# Altium schematic sheet CPU.SchDoc: param:Title
size A4; Author: param.Autor; Version: param:Version
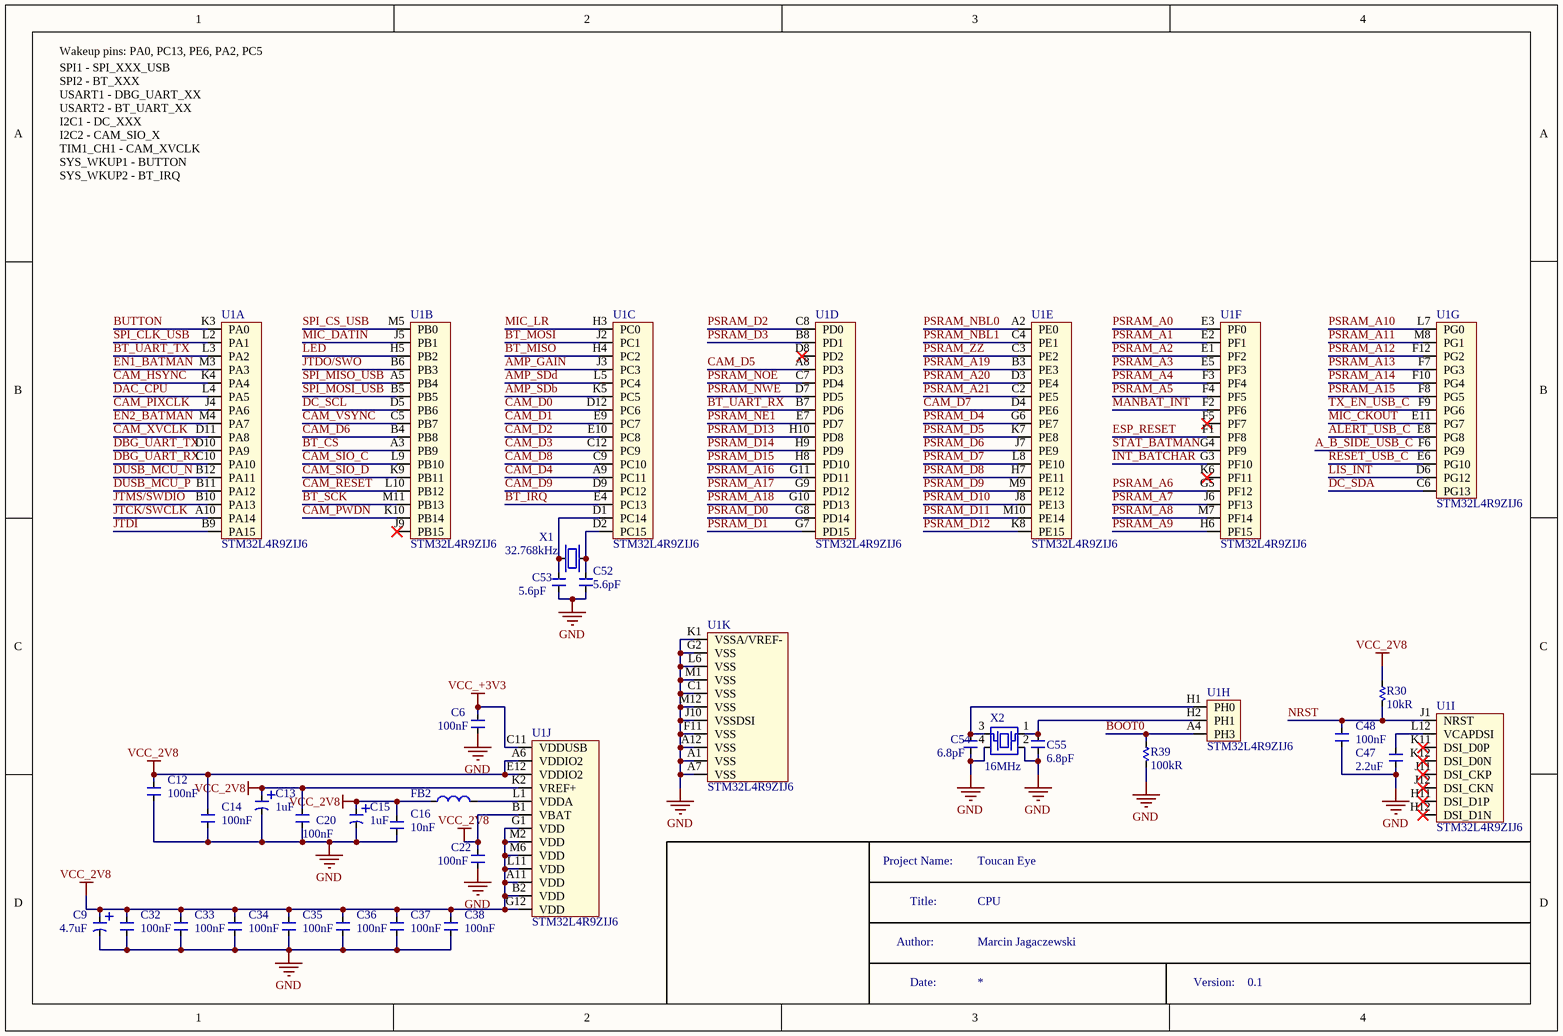
[diagram p0: CPU.SchDoc]

## Parts
C6  Capacitance: 100nF  [C_0201]  (hidden comment: C0201_100n_GRM033R6YA104KE14D)
C9  Capacitance: 4.7uF  [C_3216]  (hidden comment: C_4.7u_TANTAL_A_TAJA475K016UNJ)
C12  Capacitance: 100nF  [C_0201]  (hidden comment: C0201_100n_GRM033R6YA104KE14D)
C13  Capacitance: 1uF  [C_3216]  (hidden comment: C_1u_TANTAL_A_293D105X0025A2TE3)
C14  Capacitance: 100nF  [C_0201]  (hidden comment: C0201_100n_GRM033R6YA104KE14D)
C15  Capacitance: 1uF  [C_3216]  (hidden comment: C_1u_TANTAL_A_293D105X0025A2TE3)
C16  Capacitance: 10nF  [C_0201]  (hidden comment: C0201_10n_CGA1A2X7R1A103K030BA)
C20  Capacitance: 100nF  [C_0201]  (hidden comment: C0201_100n_GRM033R6YA104KE14D)
C22  Capacitance: 100nF  [C_0201]  (hidden comment: C0201_100n_GRM033R6YA104KE14D)
C32  Capacitance: 100nF  [C_0201]  (hidden comment: C0201_100n_GRM033R6YA104KE14D)
C33  Capacitance: 100nF  [C_0201]  (hidden comment: C0201_100n_GRM033R6YA104KE14D)
C34  Capacitance: 100nF  [C_0201]  (hidden comment: C0201_100n_GRM033R6YA104KE14D)
C35  Capacitance: 100nF  [C_0201]  (hidden comment: C0201_100n_GRM033R6YA104KE14D)
C36  Capacitance: 100nF  [C_0201]  (hidden comment: C0201_100n_GRM033R6YA104KE14D)
C37  Capacitance: 100nF  [C_0201]  (hidden comment: C0201_100n_GRM033R6YA104KE14D)
C38  Capacitance: 100nF  [C_0201]  (hidden comment: C0201_100n_GRM033R6YA104KE14D)
C47  Capacitance: 2.2uF  [C_0402]  (hidden comment: C0402_2.2u_GRT155R61E225KE13D)
C48  Capacitance: 100nF  [C_0201]  (hidden comment: C0201_100n_GRM033R6YA104KE14D)
C52  Capacitance: 5.6pF  [C_0201]  (hidden comment: C0201_5.6pF_GRM0335C1H5R6BA01D)
C53  Capacitance: 5.6pF  [C_0201]  (hidden comment: C0201_5.6pF_GRM0335C1H5R6BA01D)
C54  Capacitance: 6.8pF  [C_0201]  (hidden comment: C0201_6.8pF_GJM0335C1E6R8CB01D)
C55  Capacitance: 6.8pF  [C_0201]  (hidden comment: C0201_6.8pF_GJM0335C1E6R8CB01D)
FB2  BLM15AG121SN1D  [L_0402]  (value not drawn)
R30  Resistance: 10kR  [R_0201]  (hidden comment: R0201_10k_ERJ-1GNF1002C)
R39  Resistance: 100kR  [R_0201]  (hidden comment: R0201_100k_CRCW0201100KJN-ED)
U1  STM32L4R9ZIJ6  [BGA144C80P12X12_1000X1000X60]  (parts A,B,C,D,E,F,G,H,I,J,K of 11)
X1  Frequency: 32.768kHz  [CRYSTAL_1.6X1]  (hidden comment: ABS05-32.768KHZ-9-T)
X2  Freq: 16MHz  [CRYSTAL_2.5x2]  (hidden comment: CX2520DB16000F0FDFC1)

## Nets
GND: C6.2 C9.2 C12.2 C13.2 C14.2 C15.2 C16.2 C20.2 C22.1 C32.1 C33.1 C34.1 C35.1 C36.1 C37.1 C38.1 C47.1 C48.1 C52.1 C53.2 C54.2 C55.1 R39.1 U1.A1(VSS) U1.A7(VSS) U1.A12(VSS) U1.C1(VSS) U1.F11(VSS) U1.G2(VSS) U1.J10(VSSDSI) U1.K1(VSSA/VREF-) U1.L6(VSS) U1.M1(VSS) U1.M12(VSS) X2.2 X2.4
VCC_2V8: C9.1 C12.1 C13.1 C14.1 C15.1 C16.1 C20.1 C22.2 C32.2 C33.2 C34.2 C35.2 C36.2 C37.2 C38.2 FB2.1(Vcc) R30.2 U1.A6(VDDIO2) U1.A11(VDD) U1.B1(VBAT) U1.B2(VDD) U1.E12(VDDIO2) U1.G1(VDD) U1.G12(VDD) U1.K2(VREF+) U1.L11(VDD) U1.M2(VDD) U1.M6(VDD)
VCC_+3V3: C6.1 U1.C11(VDDUSB)
A_B_SIDE_USB_C: U1.F6(PG9)
ALERT_USB_C: U1.E8(PG8)
AMP_GAIN: U1.J3(PC3)
AMP_~{SDb}: U1.K5(PC5)
AMP_~{SDd}: U1.L5(PC4)
BOOT0: R39.2 U1.A4(PH3)
BT_CS: U1.A3(PB9)
BT_IRQ: U1.E4(PC13)
BT_MISO: U1.H4(PC2)
BT_MOSI: U1.J2(PC1)
BT_SCK: U1.M11(PB13)
BT_UART_RX: U1.B7(PD6)
BT_UART_TX: U1.L3(PA2)
BUTTON: U1.K3(PA0)
CAM_D0: U1.D12(PC6)
CAM_D1: U1.E9(PC7)
CAM_D2: U1.E10(PC8)
CAM_D3: U1.C12(PC9)
CAM_D4: U1.A9(PC11)
CAM_D5: U1.A8(PD3)
CAM_D6: U1.B4(PB8)
CAM_D7: U1.D4(PE6)
CAM_D8: U1.C9(PC10)
CAM_D9: U1.D9(PC12)
CAM_HSYNC: U1.K4(PA4)
CAM_PIXCLK: U1.J4(PA6)
CAM_PWDN: U1.K10(PB14)
CAM_RESET: U1.L10(PB12)
CAM_SIO_C: U1.L9(PB10)
CAM_SIO_D: U1.K9(PB11)
CAM_VSYNC: U1.C5(PB7)
CAM_XVCLK: U1.D11(PA8)
DAC_CPU: U1.L4(PA5)
DBG_UART_RX: U1.C10(PA10)
DBG_UART_TX: U1.D10(PA9)
DC_SCL: U1.D5(PB6)
DC_SDA: U1.C6(PG13)
DUSB_MCU_N: U1.B12(PA11)
DUSB_MCU_P: U1.B11(PA12)
EN1_BATMAN: U1.M3(PA3)
EN2_BATMAN: U1.M4(PA7)
ESP_RESET: U1.F1(PF8)
INT_BATCHAR: U1.G3(PF10)
JTCK/SWCLK: U1.A10(PA14)
JTDI: U1.B9(PA15)
JTDO/SWO: U1.B6(PB3)
JTMS/SWDIO: U1.B10(PA13)
LED: U1.H5(PB2)
LIS_INT: U1.D6(PG12)
MANBAT_INT: U1.F2(PF6)
MIC_CKOUT: U1.E11(PG7)
MIC_DATIN: U1.J5(PB1)
MIC_LR: U1.H3(PC0)
NRST: C48.2 R30.1 U1.J1(NRST)
PSRAM_A0: U1.E3(PF0)
PSRAM_A1: U1.E2(PF1)
PSRAM_A2: U1.E1(PF2)
PSRAM_A3: U1.E5(PF3)
PSRAM_A4: U1.F3(PF4)
PSRAM_A5: U1.F4(PF5)
PSRAM_A6: U1.G5(PF12)
PSRAM_A7: U1.J6(PF13)
PSRAM_A8: U1.M7(PF14)
PSRAM_A9: U1.H6(PF15)
PSRAM_A10: U1.L7(PG0)
PSRAM_A11: U1.M8(PG1)
PSRAM_A12: U1.F12(PG2)
PSRAM_A13: U1.F7(PG3)
PSRAM_A14: U1.F10(PG4)
PSRAM_A15: U1.F8(PG5)
PSRAM_A16: U1.G11(PD11)
PSRAM_A17: U1.G9(PD12)
PSRAM_A18: U1.G10(PD13)
PSRAM_A19: U1.B3(PE3)
PSRAM_A20: U1.D3(PE4)
PSRAM_A21: U1.C2(PE5)
PSRAM_D0: U1.G8(PD14)
PSRAM_D1: U1.G7(PD15)
PSRAM_D2: U1.C8(PD0)
PSRAM_D3: U1.B8(PD1)
PSRAM_D4: U1.G6(PE7)
PSRAM_D5: U1.K7(PE8)
PSRAM_D6: U1.J7(PE9)
PSRAM_D7: U1.L8(PE10)
PSRAM_D8: U1.H7(PE11)
PSRAM_D9: U1.M9(PE12)
PSRAM_D10: U1.J8(PE13)
PSRAM_D11: U1.M10(PE14)
PSRAM_D12: U1.K8(PE15)
PSRAM_D13: U1.H10(PD8)
PSRAM_D14: U1.H9(PD9)
PSRAM_D15: U1.H8(PD10)
PSRAM_NBL0: U1.A2(PE0)
PSRAM_NBL1: U1.C4(PE1)
PSRAM_NE1: U1.E7(PD7)
PSRAM_NOE: U1.C7(PD4)
PSRAM_NWE: U1.D7(PD5)
PSRAM_ZZ: U1.C3(PE2)
RESET_USB_C: U1.E6(PG10)
SPI_CLK_USB: U1.L2(PA1)
SPI_CS_USB: U1.M5(PB0)
SPI_MISO_USB: U1.A5(PB4)
SPI_MOSI_USB: U1.B5(PB5)
STAT_BATMAN: U1.G4(PF9)
TX_EN_USB_C: U1.F9(PG6)
NetC47_2: C47.2 U1.L12(VCAPDSI)
NetC52_2: C52.2 U1.D2(PC15) X1.2
NetC53_1: C53.1 U1.D1(PC14) X1.1
NetC54_1: C54.1 U1.H1(PH0) X2.3
NetC55_2: C55.2 U1.H2(PH1) X2.1
NetFB2_2: FB2.2(Vcc) U1.L1(VDDA)

Not connected (* = marked no-connect by the designer): U1 D8(PD2)* F5(PF7)* H11(DSI_D1P)* H12(DSI_D1N)* J9(PB15)* J11(DSI_CKP)* J12(DSI_CKN)* K6(PF11)* K11(DSI_D0P)* K12(DSI_D0N)*

## Notes on the sheet
- Wakeup pins: PA0, PC13, PE6, PA2, PC5
- SPI1 - SPI_XXX_USB
  SPI2 - BT_XXX
  USART1 - DBG_UART_XX
  USART2 - BT_UART_XX
  I2C1 - DC_XXX
  I2C2 - CAM_SIO_X
  TIM1_CH1 - CAM_XVCLK
  SYS_WKUP1 - BUTTON
  SYS_WKUP2 - BT_IRQ
- Project Name:
- Title:
- CPU
- Toucan Eye
- Author:
- Date:
- Marcin Jagaczewski
- Version:
- 0.1

## Library data of the parts
C6 C12 C14 C20 C22 C32-C38 C48 = C0201_100n_GRM033R6YA104KE14D: Multilayer Ceramic Capacitors MLCC - SMD/SMT 0201 0.10uF 35volts *Derate Voltage/Temp; Manufacturer: Murata; Tolerance: 10%; Dielectric: X5R; Voltage Rating (DC): 35V; Supplier 1: Mouser; Manufacturer Part Number: GRM033R6YA104KE14D; Stock 1: 295799; Pricing 1: 1=0.1, 10=0.061, 50=0.061, 100=0.027, 1000=0.015, 10000=0.01 (USD); Mount: Surface Mount; Case/Package: 0201; Weight: 1.2E-05oz; Case Code (Metric): 0603; Case Code (Imperial): 0201; Min Operating Temperature: -55°C; Max Operating Temperature: 85°C; Packaging: Tape and Reel; Voltage Rating: 35V; Termination: SMD/SMT; Package Quantity: 15000; Length: 0.024inch; Height: 0.3mm; Width: 0.3mm; Thickness: 0.013inch; ComponentLink1URL: http://www.mouser.com/ds/2/281/c02e-2905.pdf; ComponentLink1Description: http://www.mouser.com/ds/2/281/c02e-2905.pdf; ComponentLink2URL: http://search.murata.co.jp/Ceramy/image/img/A01X/partnumbering_e_01.pdf; ComponentLink2Description: http://search.murata.co.jp/Ceramy/image/img/A01X/partnumbering_e_01.pdf; *SCHChecked: *; *PCBChecked: *; Supplier Part Number 1: 81-GRM33R6YA104KE14D
C9 = C_4.7u_TANTAL_A_TAJA475K016UNJ: TANTALUM CHIPS, TAN; Manufacturer: Kyocera AVX; *SCHChecked: 1; Supplier 1: Mouser; Manufacturer Part Number: TAJA475K016UNJ; Stock 1: 7169; Pricing 1: 1=0.11, 10=0.11, 50=0.098, 100=0.088, 1000=0.064, 10000=0.056 (USD); Supplier Part Number 1: 581-TAJA475K016UNJ; *PCBChecked: 1
C13 C15 = C_1u_TANTAL_A_293D105X0025A2TE3: CAP TANT 1UF 25V 20% 1206; Manufacturer: Vishay Sprague; Dielectric Material: Tantalum; ESR (Equivalent Series Resistance): 7.6R; Ripple Current: 100mA; Leakage Current: 500nA; Polarity: Polar; Dissipation Factor: 4%; Voltage Rating (DC): 200kV; *SCHChecked: 1; Supplier 1: Mouser; Manufacturer Part Number: 293D105X0025A2TE3; Stock 1: 4878; Pricing 1: 1=0.17, 10=0.139, 50=0.135, 100=0.131, 1000=0.126, 10000=0.075 (USD); Mount: Surface Mount; Case/Package: 1206; Number of Pins: 2; Case Code (Imperial): 1206; Case Code (Metric): 3216; Min Operating Temperature: -55°C; Max Operating Temperature: 125°C; Tolerance: 20%; Packaging: Tape and Reel; Voltage Rating: 25V; Package Quantity: 2000; Termination: SMD/SMT; Length: 3.2mm; Height: 1.6mm; Width: 1.6mm; Height - Seated (Max): 0.071inch; Depth: 1.6mm; Radiation Hardening: No; REACH SVHC: Unknown; Lead Free: Lead Free; ComponentLink1URL: https://datasheet.ciiva.com/16631/293d-16631739.pdf; ComponentLink1Description: https://datasheet.ciiva.com/16631/293d-16631739.pdf; ComponentLink2URL: https://datasheet.ciiva.com/11245/293d-11245007.pdf; ComponentLink2Description: https://datasheet.ciiva.com/11245/293d-11245007.pdf; ComponentLink3URL: https://datasheet.ciiva.com/22644/1910915-22644415.pdf; ComponentLink3Description: https://datasheet.ciiva.com/22644/1910915-22644415.pdf; ComponentLink4URL: https://datasheet.ciiva.com/16293/293d-16293686.pdf; ComponentLink4Description: https://datasheet.ciiva.com/16293/293d-16293686.pdf; ComponentLink5URL: https://datasheet.ciiva.com/12884/293d-239871-12884008.pdf; ComponentLink5Description: https://datasheet.ciiva.com/12884/293d-239871-12884008.pdf; ComponentLink6URL: https://datasheet.ciiva.com/268/293d-268331.pdf; ComponentLink6Description: https://datasheet.ciiva.com/268/293d-268331.pdf; Supplier Part Number 1: 74-293D105X0025A2TE3; *PCBChecked: 1
C16 = C0201_10n_CGA1A2X7R1A103K030BA: 10000pF ±10% 10V X7R Ceramic Capacitor -55°C ~ 125°C Surface Mount, MLCC 0201 (0603 Metric) 0.024" L x 0.012" W (0.60mm x 0.30mm); Manufacturer: TDK; *SCHChecked: 1; Supplier 1: Mouser; Manufacturer Part Number: CGA1A2X7R1A103K030BA; Stock 1: 84981; Pricing 1: 1=0.11, 10=0.075, 50=0.075, 100=0.03, 1000=0.02, 10000=0.015 (USD); Mount: Surface Mount; Case/Package: 0201; Weight: 6E-06oz; Case Code (Metric): 0603; Case Code (Imperial): 0201; Min Operating Temperature: -55°C; Max Operating Temperature: 125°C; Package Quantity: 15000; Packaging: Tape and Reel; Tolerance: 10%; Voltage Rating: 10V; Dielectric: X7R; Termination: SMD/SMT; Voltage Rating (DC): 10V; Length: 0.024inch; Height: 0.3mm; Width: 0.012inch; Thickness: 0.012inch; ComponentLink1URL: http://www.mouser.com/ds/2/400/lcc_automotive_general_en-843974.pdf; ComponentLink1Description: http://www.mouser.com/ds/2/400/lcc_automotive_general_en-843974.pdf; ComponentLink2URL: http://product.tdk.com/capacitor/mlcc/en/documents/mlcc_automotive_general_en.pdf; ComponentLink2Description: http://product.tdk.com/capacitor/mlcc/en/documents/mlcc_automotive_general_en.pdf; ComponentLink3URL: https://product.tdk.com/info/en/catalog/datasheets/mlcc_automotive_general_en.pdf; ComponentLink3Description: https://product.tdk.com/info/en/catalog/datasheets/mlcc_automotive_general_en.pdf; Supplier Part Number 1: 810-CGA1A2X7R1A103KA; *PCBChecked: 1
C47 = C0402_2.2u_GRT155R61E225KE13D: 2.2µF 25V Ceramic Capacitor X5R 0402 (1005 Metric) 0.039" L x 0.020" W (1.00mm x 0.50mm); Manufacturer: Murata; Tolerance: 10%; *SCHChecked: 1; Supplier 1: Mouser; Manufacturer Part Number: GRT155R61E225KE13D; Stock 1: 15349; Mount: Surface Mount; Case/Package: 0402; Case Code (Metric): 1005; Case Code (Imperial): 0402; Min Operating Temperature: -55°C; Max Operating Temperature: 85°C; Packaging: Cut Tape; Voltage Rating: 25V; Dielectric: X5R; Voltage Rating (DC): 25V; Length: 0.039inch; Width: 0.02inch; Thickness: 0.022inch; ComponentLink1URL: http://search.murata.co.jp/Ceramy/image/img/A01X/G101/ENG/GRT155R61E225KE13-01.pdf; ComponentLink1Description: http://search.murata.co.jp/Ceramy/image/img/A01X/G101/ENG/GRT155R61E225KE13-01.pdf; Supplier Part Number 1: 81-GRT155R61E225KE3D; *PCBChecked: 1
C52 C53 = C0201_5.6pF_GRM0335C1H5R6BA01D: Multilayer Ceramic Capacitors MLCC - SMD/SMT 0201 5.6pF 50volts C0G +/-0.1pF; Manufacturer: Murata; Voltage Rating: 50V; *SCHChecked: 1; Supplier 1: Mouser; Manufacturer Part Number: GRM0335C1H5R6BA01D; Stock 1: 70824; Pricing 1: 1=0.1, 10=0.018, 50=0.018, 100=0.008, 1000=0.005, 10000=0.003 (USD); Mount: Surface Mount; Case/Package: 0201; Case Code (Metric): 0603; Case Code (Imperial): 0201; Min Operating Temperature: -55°C; Max Operating Temperature: 125°C; Package Quantity: 15000; Packaging: Tape and Reel; Voltage Rating (DC): 50V; Dielectric: C0G; Termination: SMD/SMT; Length: 0.6mm; Height: 0.3mm; Width: 0.012inch; Thickness: 0.013inch; Depth: 0.3mm; ComponentLink1URL: https://datasheet.ciiva.com/29538/partnumbering-e-01-29538488.pdf; ComponentLink1Description: https://datasheet.ciiva.com/29538/partnumbering-e-01-29538488.pdf; Supplier Part Number 1: 81-GRM0335C1H5R6BA1D; *PCBChecked: 1
C54 C55 = C0201_6.8pF_GJM0335C1E6R8CB01D: CAP CER 6.8PF 25V NP0 0201; Manufacturer: Murata; Dielectric: C0G; *SCHChecked: 1; Supplier 1: Mouser; Manufacturer Part Number: GJM0335C1E6R8CB01D; Stock 1: 86677; Pricing 1: 1=0.1, 10=0.045, 50=0.045, 100=0.02, 1000=0.011, 10000=0.008 (USD); Mount: Surface Mount; Case/Package: 0201; Case Code (Imperial): 0201; Case Code (Metric): 0603; Min Operating Temperature: -55°C; Max Operating Temperature: 125°C; Package Quantity: 1; Voltage Rating: 25V; Voltage Rating (DC): 25V; Packaging: Tape and Reel; Termination: SMD/SMT; Length: 0.6mm; Height: 0.3mm; Width: 0.3mm; Thickness: 0.013inch; Depth: 0.3mm; Radiation Hardening: No; Lead Free: Lead Free; ComponentLink1URL: https://datasheet.ciiva.com/11611/product-11611316.pdf; ComponentLink1Description: https://datasheet.ciiva.com/11611/product-11611316.pdf; ComponentLink2URL: https://datasheet.ciiva.com/133/partnumbering-e-01-133418.pdf; ComponentLink2Description: https://datasheet.ciiva.com/133/partnumbering-e-01-133418.pdf; ComponentLink3URL: https://datasheet.ciiva.com/133/partnumbering-e-01-133419.pdf; ComponentLink3Description: https://datasheet.ciiva.com/133/partnumbering-e-01-133419.pdf; ComponentLink4URL: https://datasheet.ciiva.com/11611/product-11611254.pdf; ComponentLink4Description: https://datasheet.ciiva.com/11611/product-11611254.pdf; ComponentLink5URL: https://datasheet.ciiva.com/133/partnumbering-e-01-133417.pdf; ComponentLink5Description: https://datasheet.ciiva.com/133/partnumbering-e-01-133417.pdf; Supplier Part Number 1: 81-GJM0335C1E6R8CB01; *PCBChecked: 1
FB2 = BLM15AG121SN1D: MURATA         BLM15AG121SN1D             FERRITE BEAD, 0.25OHM, 500MA, 0402; Material: Steel,Ferrite; Impedance: 120R; Tolerance: 25%; DC Resistance (DCR): 190mR; Current Rating: 550mA; Test Frequency: 100MHz; Number of Lines: 1; Shielding: Unshielded; Supplier 1: Mouser; Manufacturer: Murata; Manufacturer Part Number: BLM15AG121SN1D; Stock 1: 102744; Pricing 1: 1=0.1, 10=0.06, 50=0.06, 100=0.035, 1000=0.025, 10000=0.02 (USD); Case/Package: 0402; Number of Pins: 2; Core Material: Ferrite; Case Code (Metric): 1005; Case Code (Imperial): 0402; Min Operating Temperature: -55°C; Max Operating Temperature: 125°C; Max DC Current: 500mA; Package Quantity: 1; Packaging: Tape and Reel; Max Current Rating: 550mA; Termination: SMD/SMT; DC Current: 500mA; Military Standard: Not; Frequency: 100MHz; Number of Circuits: 1; Length: 1mm; Height: 0.5mm; Width: 0.5mm; Depth: 0.55mm; Radiation Hardening: No; REACH SVHC: No SVHC; Lead Free: Lead Free; ComponentLink1URL: https://datasheet.ciiva.com/34302/1844660-34302798.pdf; ComponentLink1Description: https://datasheet.ciiva.com/34302/1844660-34302798.pdf; ComponentLink2URL: https://datasheet.ciiva.com/18090/getdatasheetpartid-210548-18090179.pdf; ComponentLink2Description: https://datasheet.ciiva.com/18090/getdatasheetpartid-210548-18090179.pdf; ComponentLink3URL: https://datasheet.ciiva.com/11800/0900766b811b5866-11800861.pdf; ComponentLink3Description: https://datasheet.ciiva.com/11800/0900766b811b5866-11800861.pdf; ComponentLink4URL: https://datasheet.ciiva.com/41449/001172160-da-01-en-drossel-0402-120r-1-0x0-5mm-10000st-41449449.pdf; ComponentLink4Description: https://datasheet.ciiva.com/41449/001172160-da-01-en-drossel-0402-120r-1-0x0-5mm-10000st-41449449.pdf; ComponentLink5URL: https://datasheet.ciiva.com/29347/442175-da-01-en-chip-drossel-0402-120r-500ma-1-0x0-5mm-29347874.pdf; ComponentLink5Description: https://datasheet.ciiva.com/29347/442175-da-01-en-chip-drossel-0402-120r-500ma-1-0x0-5mm-29347874.pdf; ComponentLink6URL: https://datasheet.ciiva.com/6212/l0110s0100blm15ag-sn-6212527.pdf; ComponentLink6Description: https://datasheet.ciiva.com/6212/l0110s0100blm15ag-sn-6212527.pdf; ComponentLink7URL: https://datasheet.ciiva.com/14122/blm-series-eng-tds-14122927.pdf; ComponentLink7Description: https://datasheet.ciiva.com/14122/blm-series-eng-tds-14122927.pdf; ComponentLink8URL: https://datasheet.ciiva.com/3081/l0110s0100blm15ag-sn-3081599.pdf; ComponentLink8Description: https://datasheet.ciiva.com/3081/l0110s0100blm15ag-sn-3081599.pdf; ComponentLink9URL: https://datasheet.ciiva.com/3081/l0110s0100blm15ag-sn-3081598.pdf; ComponentLink9Description: https://datasheet.ciiva.com/3081/l0110s0100blm15ag-sn-3081598.pdf; ComponentLink10URL: https://datasheet.ciiva.com/1466/5144-1466741.pdf; ComponentLink10Description: https://datasheet.ciiva.com/1466/5144-1466741.pdf; ComponentLink11URL: https://datasheet.ciiva.com/1466/5144-1466740.pdf; ComponentLink11Description: https://datasheet.ciiva.com/1466/5144-1466740.pdf; ComponentLink12URL: https://datasheet.ciiva.com/17279/l0110s0100blm15ag-sn-17279627.pdf; ComponentLink12Description: https://datasheet.ciiva.com/17279/l0110s0100blm15ag-sn-17279627.pdf; ComponentLink13URL: https://datasheet.ciiva.com/6212/l0110s0100blm15ag-sn-6212533.pdf; ComponentLink13Description: https://datasheet.ciiva.com/6212/l0110s0100blm15ag-sn-6212533.pdf; *SCHChecked: 1; *PCBChecked: 1; Supplier Part Number 1: 81-BLM15AG121SN1D
R30 = R0201_10k_ERJ-1GNF1002C: RESISTOR, 0201, 0.05W, 1%, 10K; Manufacturer: Panasonic ECG; Temperature Coefficient: 200ppm/°C; Power Rating: 50mW; Voltage Rating: 25V; *SCHChecked: 1; Supplier 1: Mouser; Manufacturer Part Number: ERJ-1GNF1002C; Stock 1: 896102; Pricing 1: 1=0.49, 10=0.045, 50=0.045, 100=0.018, 1000=0.013, 10000=0.007 (USD); Mount: Surface Mount; Case/Package: 0201; Number of Pins: 2; Contact Plating: Tin,Matte; Case Code (Metric): 0603; Case Code (Imperial): 0201; Min Operating Temperature: -55°C; Max Operating Temperature: 125°C; Tolerance: 1%; Composition: Thick Film; Packaging: Tape and Reel; Package Quantity: 15000; Number of Terminations: 2; Military Standard: Not; Max Power Dissipation: 50mW; Voltage Rating (DC): 25V; Length: 0.6mm; Height: 0.01inch; Width: 0.012inch; Depth: 0.3mm; Radiation Hardening: No; REACH SVHC: Unknown; Lead Free: Lead Free; ComponentLink1URL: https://datasheet.ciiva.com/16508/aoa0000ce2-16508478.pdf; ComponentLink1Description: https://datasheet.ciiva.com/16508/aoa0000ce2-16508478.pdf; ComponentLink2URL: https://datasheet.ciiva.com/28514/1678782-28514095.pdf; ComponentLink2Description: https://datasheet.ciiva.com/28514/1678782-28514095.pdf; ComponentLink3URL: https://datasheet.ciiva.com/28514/1678782-28514085.pdf; ComponentLink3Description: https://datasheet.ciiva.com/28514/1678782-28514085.pdf; ComponentLink4URL: https://datasheet.ciiva.com/43467/1678782-43467078.pdf; ComponentLink4Description: https://datasheet.ciiva.com/43467/1678782-43467078.pdf; *PCBChecked: 1; Supplier Part Number 1: 667-ERJ-1GNF1002C
R39 = R0201_100k_CRCW0201100KJN-ED: RES SMD 100K OHM 5% 1/20W 0201; Manufacturer: Vishay Dale; Voltage Rating: 30V; Power Rating: 50mW; Temperature Coefficient: 200ppm/°C; *SCHChecked: 1; Supplier 1: Mouser; Manufacturer Part Number: CRCW0201100KJN-ED; Stock 1: 126286; Pricing 1: 1=0.13, 10=0.063, 50=0.063, 100=0.028, 1000=0.017, 10000=0.013 (USD); Case/Package: 0201; Number of Pins: 2; Weight: 6E-06oz; Case Code (Imperial): 0201; Case Code (Metric): 0603; Contact Plating: Tin; Min Operating Temperature: -55°C; Max Operating Temperature: 155°C; Tolerance: 5%; Packaging: Tape and Reel; Package Quantity: 1; Composition: Thick Film; Number of Terminations: 2; Military Standard: Not; Max Power Dissipation: 50mW; Voltage Rating (DC): 30V; Length: 0.6mm; Height: 0.011inch; Width: 0.3mm; Depth: 0.3mm; Radiation Hardening: No; REACH SVHC: Unknown; Lead Free: Lead Free; ComponentLink1URL: https://datasheet.ciiva.com/2498/crcw0201e3-2498781.pdf; ComponentLink1Description: https://datasheet.ciiva.com/2498/crcw0201e3-2498781.pdf; ComponentLink2URL: https://datasheet.ciiva.com/16436/dcrcwe3-16436221.pdf; ComponentLink2Description: https://datasheet.ciiva.com/16436/dcrcwe3-16436221.pdf; ComponentLink3URL: https://datasheet.ciiva.com/2498/crcw0201e3-2498779.pdf; ComponentLink3Description: https://datasheet.ciiva.com/2498/crcw0201e3-2498779.pdf; ComponentLink4URL: https://datasheet.ciiva.com/2498/crcw0201e3-2498780.pdf; ComponentLink4Description: https://datasheet.ciiva.com/2498/crcw0201e3-2498780.pdf; *PCBChecked: 1; Supplier Part Number 1: 71-CRCW0201100KJNED
U1 = STM32L4R9ZIJ6: *SCHChecked: 1; *PCBChecked: *; Supplier: MASTERS; Symbol: STM32L4R9ZIJ6; Symbol supplier: STM32L4R9ZIJ6
X1 = ABS05-32.768KHZ-9-T: 32.768kHz ±20ppm Crystal 9pF 90 kOhm -40°C ~ 85°C  Surface Mount 2-SMD; Manufacturer: Abracon; ESR (Equivalent Series Resistance): 90kR; *SCHChecked: 1; Supplier 1: Mouser; Manufacturer Part Number: ABS05-32.768KHZ-9-T; Stock 1: 11805; Pricing 1: 1=1.6, 10=1.54, 50=1.51, 100=1.29, 1000=1.01, 10000=0.885 (USD); Mount: Surface Mount; Case/Package: SMD/SMT; Number of Pins: 2; Min Operating Temperature: -40°C; Max Operating Temperature: 85°C; Tolerance: 20ppm; Frequency Tolerance: 20ppm; Load Capacitance: 9pF; Packaging: Tape and Reel; Package Quantity: 3000; Termination: SMD/SMT; Series Resistance: 90kR; Length: 1.6mm; Height: 0.02inch; Width: 0.039inch; Depth: 1mm; Radiation Hardening: No; REACH SVHC: No SVHC; Lead Free: Lead Free; ComponentLink1URL: https://datasheet.ciiva.com/12387/abs05-25797-12387306.pdf; ComponentLink1Description: https://datasheet.ciiva.com/12387/abs05-25797-12387306.pdf; ComponentLink2URL: https://datasheet.ciiva.com/48668/abs05-48668569.pdf; ComponentLink2Description: https://datasheet.ciiva.com/48668/abs05-48668569.pdf; ComponentLink3URL: https://datasheet.ciiva.com/16411/abs05-16411147.pdf; ComponentLink3Description: https://datasheet.ciiva.com/16411/abs05-16411147.pdf; ComponentLink4URL: https://datasheet.ciiva.com/6728/abs05-6728951.pdf; ComponentLink4Description: https://datasheet.ciiva.com/6728/abs05-6728951.pdf; ComponentLink5URL: https://datasheet.ciiva.com/6728/abs05-6728952.pdf; ComponentLink5Description: https://datasheet.ciiva.com/6728/abs05-6728952.pdf; ComponentLink6URL: https://datasheet.ciiva.com/6728/abs05-6728953.pdf; ComponentLink6Description: https://datasheet.ciiva.com/6728/abs05-6728953.pdf; Supplier Part Number 1: 815-ABS05-32.768K9T; *PCBChecked: 1
X2 = CX2520DB16000F0FDFC1: Manufacturer: Kyocera AVX; *PCBChecked: 1; Supplier 1: Mouser; Manufacturer Part Number: CX2520DB16000F0FDFC1; Stock 1: 0; Supplier Part Number 1: 581-CX2520DB16F0FDFC; *SCHChecked: 1